# EAGLE design 1highfront (EAGLE 4.11)
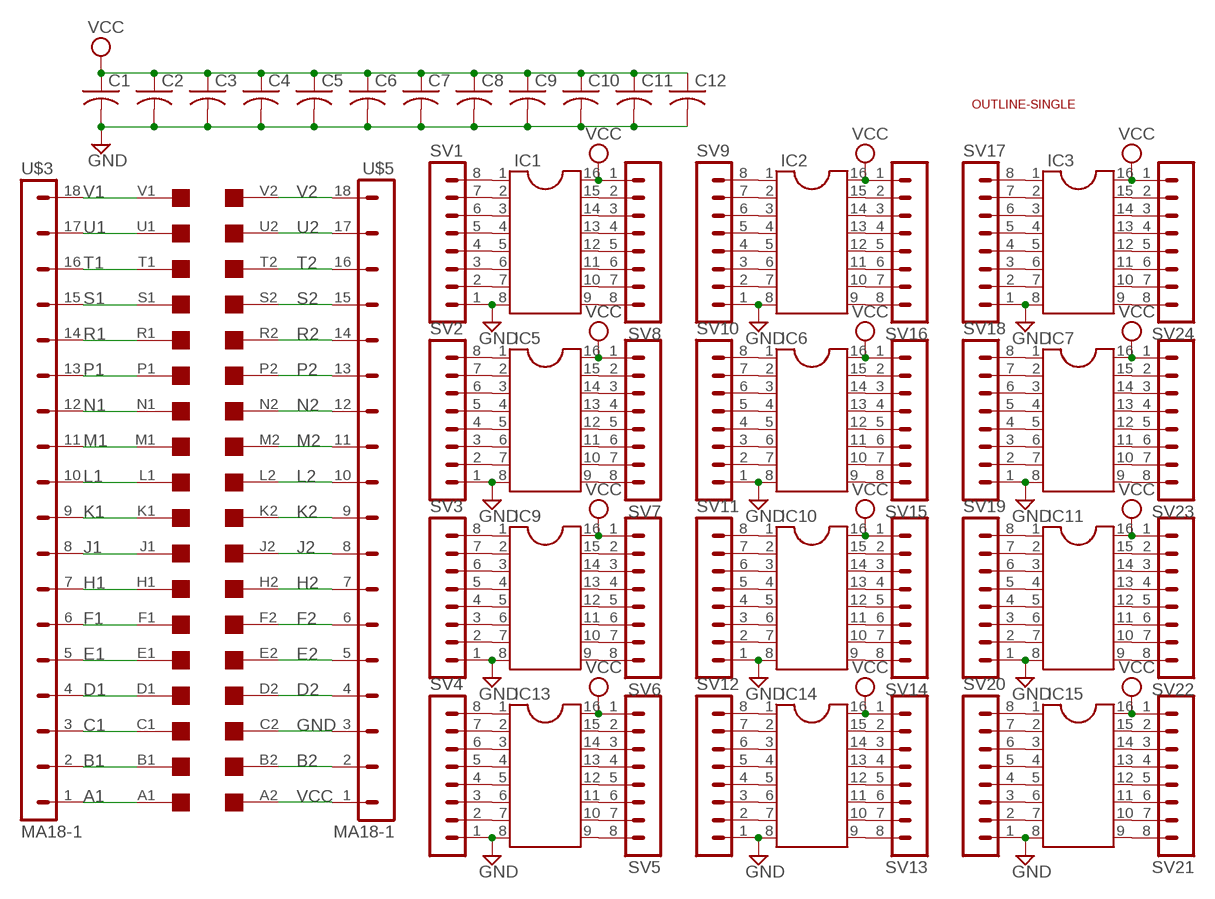
[diagram p0: schematic, sheet 1]

## Parts
C1  C-US050-025X075  [C050-025X075]
C2  C-US050-025X075  [C050-025X075]
C3  C-US050-025X075  [C050-025X075]
C4  C-US050-025X075  [C050-025X075]
C5  C-US050-025X075  [C050-025X075]
C6  C-US050-025X075  [C050-025X075]
C7  C-US050-025X075  [C050-025X075]
C8  C-US050-025X075  [C050-025X075]
C9  C-US050-025X075  [C050-025X075]
C10  C-US050-025X075  [C050-025X075]
C11  C-US050-025X075  [C050-025X075]
C12  C-US050-025X075  [C050-025X075]
IC1  DIL16  [DIL16]
IC2  DIL16  [DIL16]
IC3  DIL16  [DIL16]
IC5  DIL16  [DIL16]
IC6  DIL16  [DIL16]
IC7  DIL16  [DIL16]
IC9  DIL16  [DIL16]
IC10  DIL16  [DIL16]
IC11  DIL16  [DIL16]
IC13  DIL16  [DIL16]
IC14  DIL16  [DIL16]
IC15  DIL16  [DIL16]
SV1  MA08-1  [MA08-1]
SV2  MA08-1  [MA08-1]
SV3  MA08-1  [MA08-1]
SV4  MA08-1  [MA08-1]
SV5  MA08-1  [MA08-1]
SV6  MA08-1  [MA08-1]
SV7  MA08-1  [MA08-1]
SV8  MA08-1  [MA08-1]
SV9  MA08-1  [MA08-1]
SV10  MA08-1  [MA08-1]
SV11  MA08-1  [MA08-1]
SV12  MA08-1  [MA08-1]
SV13  MA08-1  [MA08-1]
SV14  MA08-1  [MA08-1]
SV15  MA08-1  [MA08-1]
SV16  MA08-1  [MA08-1]
SV17  MA08-1  [MA08-1]
SV18  MA08-1  [MA08-1]
SV19  MA08-1  [MA08-1]
SV20  MA08-1  [MA08-1]
SV21  MA08-1  [MA08-1]
SV22  MA08-1  [MA08-1]
SV23  MA08-1  [MA08-1]
SV24  MA08-1  [MA08-1]
U$2  OUTLINE-SINGLE  [SINGLE]
U$3  MA18-1  [MA18-1]
U$4  EDGE-2CONNECTOR  [EDGE-CON2]
U$5  MA18-1  [MA18-1]

## Nets
A1: U$3.1 U$4.A1
B1: U$3.2 U$4.B1
B2: U$4.B2 U$5.2
C1: U$3.3 U$4.C1
D1: U$3.4 U$4.D1
D2: U$4.D2 U$5.4
E1: U$3.5 U$4.E1
E2: U$4.E2 U$5.5
F1: U$3.6 U$4.F1
F2: U$4.F2 U$5.6
GND: C1.2 C2.2 C3.2 C4.2 C5.2 C6.2 C7.2 C8.2 C9.2 C10.2 C11.2 C12.2 IC1.8 IC2.8 IC3.8 IC5.8 IC6.8 IC7.8 IC9.8 IC10.8 IC11.8 IC13.8 IC14.8 IC15.8 SV1.1 SV2.1 SV3.1 SV4.1 SV9.1 SV10.1 SV11.1 SV12.1 SV17.1 SV18.1 SV19.1 SV20.1 U$4.C2 U$5.3
H1: U$3.7 U$4.H1
H2: U$4.H2 U$5.7
J1: U$3.8 U$4.J1
J2: U$4.J2 U$5.8
K1: U$3.9 U$4.K1
K2: U$4.K2 U$5.9
L1: U$3.10 U$4.L1
L2: U$4.L2 U$5.10
M1: U$3.11 U$4.M1
M2: U$4.M2 U$5.11
N1: U$3.12 U$4.N1
N2: U$4.N2 U$5.12
N$1: IC1.7 SV1.2
N$2: IC1.6 SV1.3
N$3: IC1.5 SV1.4
N$4: IC1.4 SV1.5
N$5: IC1.3 SV1.6
N$6: IC1.2 SV1.7
N$7: IC1.1 SV1.8
N$8: IC5.7 SV2.2
N$9: IC5.6 SV2.3
N$10: IC5.5 SV2.4
N$11: IC5.4 SV2.5
N$12: IC5.3 SV2.6
N$13: IC5.2 SV2.7
N$14: IC5.1 SV2.8
N$15: IC9.7 SV3.2
N$16: IC9.6 SV3.3
N$17: IC9.5 SV3.4
N$18: IC9.4 SV3.5
N$19: IC9.3 SV3.6
N$20: IC9.2 SV3.7
N$21: IC9.1 SV3.8
N$22: IC13.7 SV4.2
N$23: IC13.6 SV4.3
N$24: IC13.5 SV4.4
N$25: IC13.4 SV4.5
N$26: IC13.3 SV4.6
N$27: IC13.2 SV4.7
N$28: IC13.1 SV4.8
N$29: IC2.1 SV9.8
N$30: IC2.2 SV9.7
N$31: IC2.3 SV9.6
N$32: IC2.4 SV9.5
N$33: IC2.5 SV9.4
N$34: IC2.6 SV9.3
N$35: IC2.7 SV9.2
N$36: IC6.1 SV10.8
N$37: IC6.2 SV10.7
N$38: IC6.3 SV10.6
N$39: IC6.4 SV10.5
N$40: IC6.5 SV10.4
N$41: IC6.6 SV10.3
N$42: IC6.7 SV10.2
N$43: IC10.1 SV11.8
N$44: IC10.2 SV11.7
N$45: IC10.3 SV11.6
N$46: IC10.4 SV11.5
N$47: IC10.5 SV11.4
N$48: IC10.6 SV11.3
N$49: IC10.7 SV11.2
N$50: IC14.1 SV12.8
N$51: IC14.2 SV12.7
N$52: IC14.3 SV12.6
N$53: IC14.4 SV12.5
N$54: IC14.5 SV12.4
N$55: IC14.6 SV12.3
N$56: IC14.7 SV12.2
N$57: IC6.15 SV15.2
N$58: IC6.14 SV15.3
N$59: IC6.13 SV15.4
N$60: IC6.12 SV15.5
N$61: IC6.11 SV15.6
N$62: IC6.10 SV15.7
N$63: IC6.9 SV15.8
N$64: IC10.15 SV14.2
N$65: IC10.14 SV14.3
N$66: IC10.13 SV14.4
N$67: IC10.12 SV14.5
N$68: IC10.11 SV14.6
N$69: IC10.10 SV14.7
N$70: IC10.9 SV14.8
N$71: IC1.9 SV8.8
N$72: IC1.10 SV8.7
N$73: IC1.11 SV8.6
N$74: IC1.12 SV8.5
N$75: IC1.13 SV8.4
N$76: IC1.14 SV8.3
N$77: IC1.15 SV8.2
N$78: IC5.9 SV7.8
N$79: IC5.10 SV7.7
N$80: IC5.11 SV7.6
N$81: IC5.12 SV7.5
N$82: IC5.13 SV7.4
N$83: IC5.14 SV7.3
N$84: IC5.15 SV7.2
N$85: IC2.15 SV16.2
N$86: IC2.14 SV16.3
N$87: IC2.13 SV16.4
N$88: IC2.12 SV16.5
N$89: IC2.11 SV16.6
N$90: IC2.10 SV16.7
N$91: IC2.9 SV16.8
N$92: IC13.15 SV5.2
N$93: IC13.14 SV5.3
N$94: IC13.13 SV5.4
N$95: IC13.12 SV5.5
N$96: IC13.11 SV5.6
N$97: IC13.10 SV5.7
N$98: IC13.9 SV5.8
N$99: IC9.15 SV6.2
N$100: IC9.14 SV6.3
N$101: IC9.13 SV6.4
N$102: IC9.12 SV6.5
N$103: IC9.11 SV6.6
N$104: IC9.10 SV6.7
N$105: IC9.9 SV6.8
N$106: IC14.15 SV13.2
N$107: IC14.14 SV13.3
N$108: IC14.13 SV13.4
N$109: IC14.12 SV13.5
N$110: IC14.11 SV13.6
N$111: IC14.10 SV13.7
N$112: IC14.9 SV13.8
N$113: IC3.7 SV17.2
N$114: IC3.6 SV17.3
N$115: IC3.5 SV17.4
N$116: IC3.4 SV17.5
N$117: IC3.3 SV17.6
N$118: IC3.2 SV17.7
N$119: IC3.1 SV17.8
N$120: IC7.7 SV18.2
N$121: IC7.6 SV18.3
N$122: IC7.5 SV18.4
N$123: IC7.4 SV18.5
N$124: IC7.3 SV18.6
N$125: IC7.2 SV18.7
N$126: IC7.1 SV18.8
N$127: IC11.7 SV19.2
N$128: IC11.6 SV19.3
N$129: IC11.5 SV19.4
N$130: IC11.4 SV19.5
N$131: IC11.3 SV19.6
N$132: IC11.2 SV19.7
N$133: IC11.1 SV19.8
N$134: IC15.7 SV20.2
N$135: IC15.6 SV20.3
N$136: IC15.5 SV20.4
N$137: IC15.4 SV20.5
N$138: IC15.3 SV20.6
N$139: IC15.2 SV20.7
N$140: IC15.1 SV20.8
N$141: IC15.15 SV21.2
N$142: IC15.14 SV21.3
N$143: IC15.13 SV21.4
N$144: IC15.12 SV21.5
N$145: IC15.11 SV21.6
N$146: IC15.10 SV21.7
N$147: IC15.9 SV21.8
N$148: IC11.15 SV22.2
N$149: IC11.14 SV22.3
N$150: IC11.13 SV22.4
N$151: IC11.12 SV22.5
N$152: IC11.11 SV22.6
N$153: IC11.10 SV22.7
N$154: IC11.9 SV22.8
N$155: IC7.15 SV23.2
N$156: IC7.14 SV23.3
N$157: IC7.13 SV23.4
N$158: IC7.12 SV23.5
N$159: IC7.11 SV23.6
N$160: IC7.10 SV23.7
N$161: IC7.9 SV23.8
N$162: IC3.15 SV24.2
N$163: IC3.14 SV24.3
N$164: IC3.13 SV24.4
N$165: IC3.12 SV24.5
N$166: IC3.11 SV24.6
N$167: IC3.10 SV24.7
N$168: IC3.9 SV24.8
P1: U$3.13 U$4.P1
P2: U$4.P2 U$5.13
R1: U$3.14 U$4.R1
R2: U$4.R2 U$5.14
S1: U$3.15 U$4.S1
S2: U$4.S2 U$5.15
T1: U$3.16 U$4.T1
T2: U$4.T2 U$5.16
U1: U$3.17 U$4.U1
U2: U$4.U2 U$5.17
V1: U$3.18 U$4.V1
V2: U$4.V2 U$5.18
VCC: C1.1 C2.1 C3.1 C4.1 C5.1 C6.1 C7.1 C8.1 C9.1 C10.1 C11.1 C12.1 IC1.16 IC2.16 IC3.16 IC5.16 IC6.16 IC7.16 IC9.16 IC10.16 IC11.16 IC13.16 IC14.16 IC15.16 SV5.1 SV6.1 SV7.1 SV8.1 SV13.1 SV14.1 SV15.1 SV16.1 SV21.1 SV22.1 SV23.1 SV24.1 U$4.A2 U$5.1

## Library data of the parts
C1-C12 = rcl:C-US: CAPACITOR, American symbol
IC1-IC3 IC5-IC7 IC9-IC11 IC13-IC15 = ic-package:DIL16: Dual In Line
SV1-SV24 = con-lstb:MA08-1: PIN HEADER
U$2 = dec-con:OUTLINE-*: Board outlines for DEC boards.
U$3 U$5 = dec-con:MA18-1
U$4 = dec-con:EDGE-2: Double-Sided DEC edge connector.

## Board
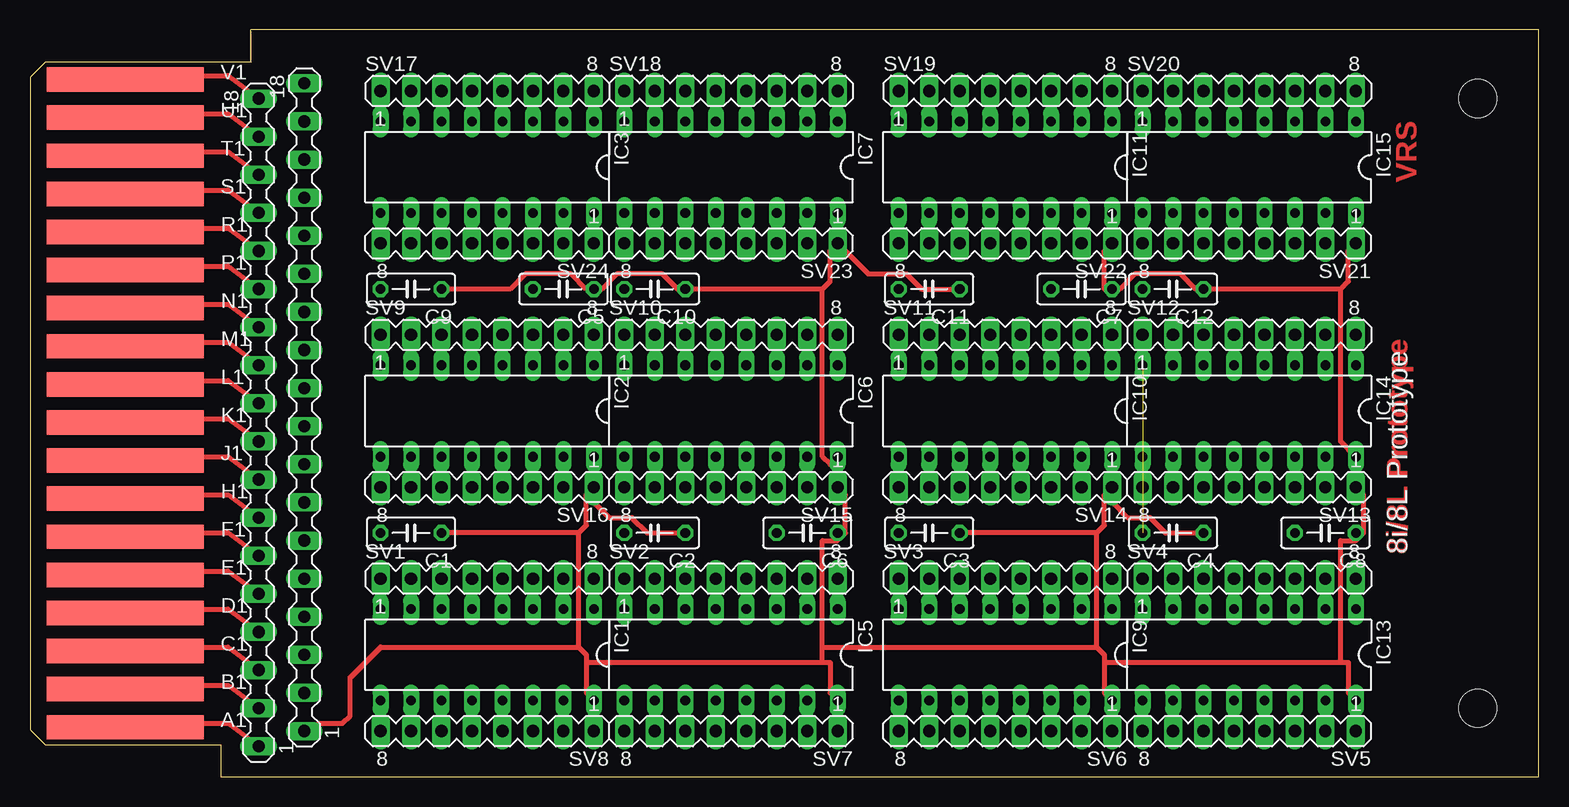
[diagram p1: board, top side]
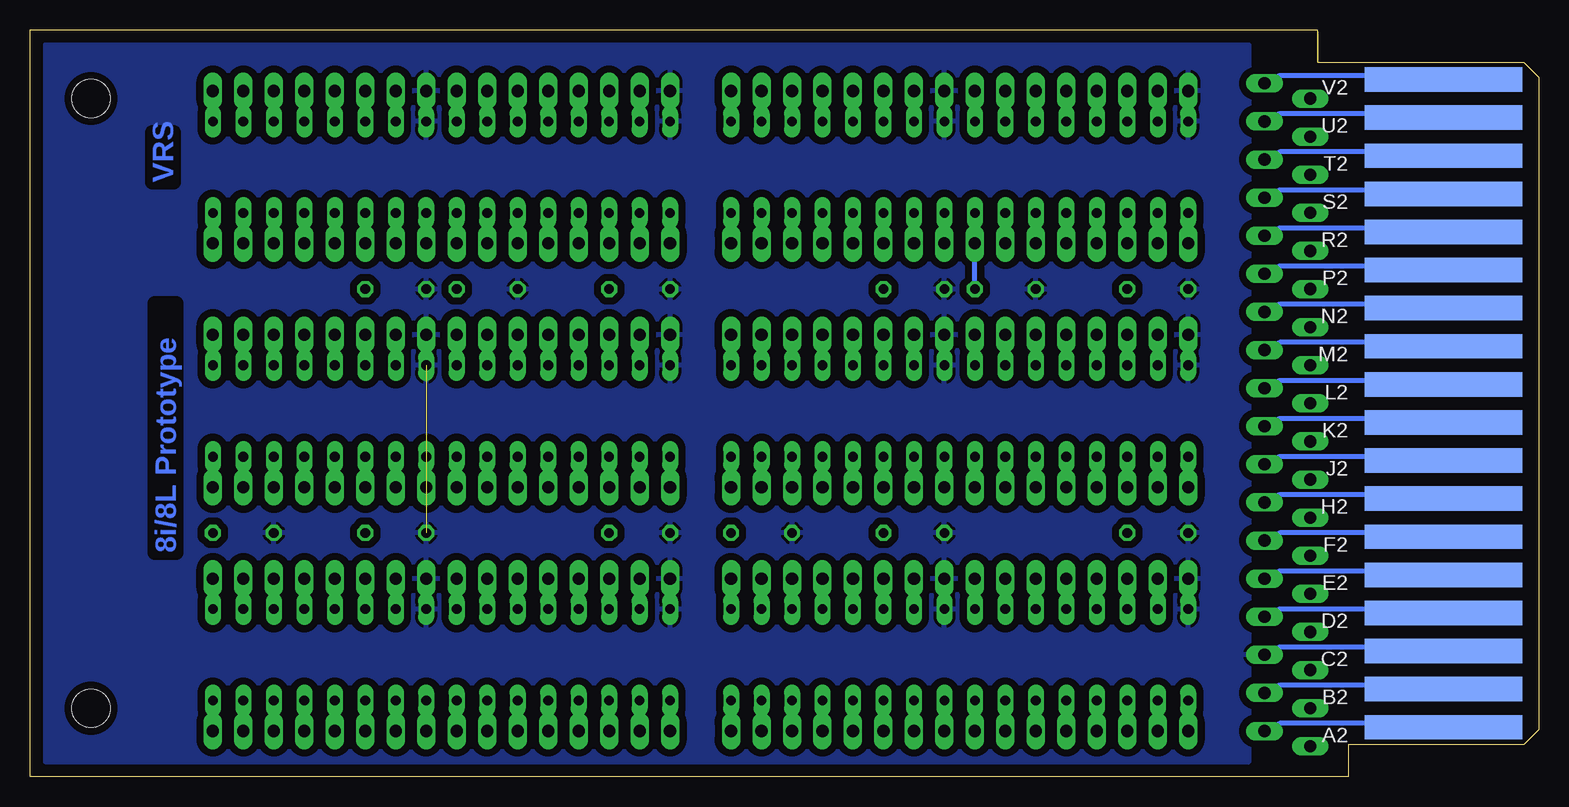
[diagram p2: board, bottom side, seen from below]

Size 125.73 x 62.23 mm. Coordinates in mm from the lower left corner, seen from the top.
Copper layers (1+16): Top 0.035mm / dielectric 1.5mm / Bottom 0.035mm
Design rules "16mils": minimum track width 16mil, minimum drill 32mil, track to track 15mil, track to pad 10mil, pad to pad 10mil, via to via 10mil, smd to smd 10mil, copper to edge 13mil, drill to drill 10mil, minimum pad ring 10mil, minimum via ring 8mil, stop-mask expansion 0mil, vias tented up to drill 0mil, thermal gap 10mil

### Footprints (pad centres in the part's own frame; a part is rotated, then mirrored left to right if it is on the bottom)
C050-025X075 = drill 0.813 octagon: 1 -2.54,0; 2 2.54,0
DIL16 = drill 0.813 long: 1 -8.89,-3.81; 2 -6.35,-3.81; 3 -3.81,-3.81; 4 -1.27,-3.81; 5 1.27,-3.81; 6 3.81,-3.81; 7 6.35,-3.81; 8 8.89,-3.81; 9 8.89,3.81; 10 6.35,3.81; 11 3.81,3.81; 12 1.27,3.81; 13 -1.27,3.81; 14 -3.81,3.81; 15 -6.35,3.81; 16 -8.89,3.81
MA08-1 = drill 1.016 long: 1 -8.89,0; 2 -6.35,0; 3 -3.81,0; 4 -1.27,0; 5 1.27,0; 6 3.81,0; 7 6.35,0; 8 8.89,0
SINGLE = hole 3.175: 120.65,56.515; 120.65,5.715
MA18-1 = drill 1.016 long: 1 -25.4,0; 2 -22.225,0; 3 -19.05,0; 4 -15.875,0; 5 -12.7,0; 6 -9.525,0; 7 -6.35,0; 8 -3.175,0; 9 0,0; 10 3.175,0; 11 6.35,0; 12 9.525,0; 13 12.7,0; 14 15.875,0; 15 19.05,0; 16 22.225,0; 17 25.4,0; 18 28.575,0
EDGE-CON2 = smd 13.106 x 2.032: A1 7.938,4.128; B1 7.938,7.303; C1 7.938,10.477; D1 7.938,13.652; E1 7.938,16.828; F1 7.938,20.003; H1 7.938,23.177; J1 7.938,26.352; K1 7.938,29.527; L1 7.938,32.703; M1 7.938,35.877; N1 7.938,39.053; P1 7.938,42.227; R1 7.938,45.403; S1 7.938,48.578; T1 7.938,51.752; U1 7.938,54.928; V1 7.938,58.102 | smd 13.106 x 2.032 bottom: A2 7.938,4.128; B2 7.938,7.303; C2 7.938,10.477; D2 7.938,13.652; E2 7.938,16.828; F2 7.938,20.003; H2 7.938,23.177; J2 7.938,26.352; K2 7.938,29.527; L2 7.938,32.703; M2 7.938,35.877; N2 7.938,39.053; P2 7.938,42.227; R2 7.938,45.403; S2 7.938,48.578; T2 7.938,51.752; U2 7.938,54.928; V2 7.938,58.102

### Placement (x,y rotation side)
C1  31.75,20.32 180 top
C2  52.07,20.32 180 top
C3  74.93,20.32 180 top
C4  95.25,20.32 180 top
C5  44.45,40.64 180 top
C6  64.77,20.32 180 top
C7  87.63,40.64 180 top
C8  107.95,20.32 180 top
C9  31.75,40.64 180 top
C10  52.07,40.64 180 top
C11  74.93,40.64 180 top
C12  95.25,40.64 180 top
IC1  38.1,10.16 180 top
IC2  38.1,30.48 180 top
IC3  38.1,50.8 180 top
IC5  58.42,10.16 180 top
IC6  58.42,30.48 180 top
IC7  58.42,50.8 180 top
IC9  81.28,10.16 180 top
IC10  81.28,30.48 180 top
IC11  81.28,50.8 180 top
IC13  101.6,10.16 180 top
IC14  101.6,30.48 180 top
IC15  101.6,50.8 180 top
SV1  38.1,16.51 0 top
SV2  58.42,16.51 0 top
SV3  81.28,16.51 0 top
SV4  101.6,16.51 0 top
SV5  101.6,3.81 180 top
SV6  81.28,3.81 180 top
SV7  58.42,3.81 180 top
SV8  38.1,3.81 180 top
SV9  38.1,36.83 0 top
SV10  58.42,36.83 0 top
SV11  81.28,36.83 0 top
SV12  101.6,36.83 0 top
SV13  101.6,24.13 180 top
SV14  81.28,24.13 180 top
SV15  58.42,24.13 180 top
SV16  38.1,24.13 180 top
SV17  38.1,57.15 0 top
SV18  58.42,57.15 0 top
SV19  81.28,57.15 0 top
SV20  101.6,57.15 0 top
SV21  101.6,44.45 180 top
SV22  81.28,44.45 180 top
SV23  58.42,44.45 180 top
SV24  38.1,44.45 180 top
U$2  0,0 0 top
U$3  19.05,27.94 90 top
U$4  0,0 0 top
U$5  22.86,29.21 90 top

### Tracks (layer width: path | path; a pad name or v marks a point on that pad's centre or on a via)
A1
  Top 0.406: U$3.1 16.51,4.45 13.97,4.45 U$4.A1
B1
  Top 0.406: U$3.2 16.51,7.62 13.97,7.62 U$4.B1
B2
  Bottom 0.406: U$5.2 21.59,7.62 13.97,7.62 U$4.B2
C1
  Top 0.406: U$3.3 16.51,10.79 13.97,10.79 U$4.C1
D1
  Top 0.406: U$3.4 16.51,13.97 13.97,13.97 U$4.D1
D2
  Bottom 0.406: U$5.4 21.59,13.97 13.97,13.97 U$4.D2
E1
  Top 0.406: U$3.5 16.51,17.14 13.97,17.14 U$4.E1
E2
  Bottom 0.406: U$5.5 21.59,17.14 13.97,17.14 U$4.E2
F1
  Top 0.406: U$3.6 16.51,20.32 13.97,20.32 U$4.F1
F2
  Bottom 0.406: U$5.6 21.59,20.32 13.97,20.32 U$4.F2
GND  (1 unrouted)
  Bottom 0.406: 24.13,10.35 24.13,10.16 U$5.3 21.59,10.79 13.97,10.79 U$4.C2
  pour Bottom (isolate 0.61): 24.13,60.96 124.46,60.96 124.46,1.27 24.13,1.27
H1
  Top 0.406: U$3.7 16.51,23.5 13.97,23.5 U$4.H1
H2
  Bottom 0.406: U$5.7 21.59,23.5 13.97,23.5 U$4.H2
J1
  Top 0.406: U$3.8 16.51,26.67 13.97,26.67 U$4.J1
J2
  Bottom 0.406: U$5.8 21.59,26.67 13.97,26.67 U$4.J2
K1
  Top 0.406: U$3.9 16.51,29.84 13.97,29.84 U$4.K1
K2
  Bottom 0.406: U$5.9 21.59,29.84 13.97,29.84 U$4.K2
L1
  Top 0.406: U$3.10 16.51,33.02 13.97,33.02 U$4.L1
L2
  Bottom 0.406: U$5.10 21.59,33.02 13.97,33.02 U$4.L2
M1
  Top 0.406: U$3.11 16.51,36.2 13.97,36.2 U$4.M1
M2
  Bottom 0.406: U$5.11 21.59,36.2 13.97,36.2 U$4.M2
N1
  Top 0.406: U$3.12 16.51,39.37 13.97,39.37 U$4.N1
N2
  Bottom 0.406: U$5.12 21.59,39.37 13.97,39.37 U$4.N2
N$1
  Bottom 0.406: IC1.7 SV1.2
N$2
  Bottom 0.406: IC1.6 SV1.3
N$3
  Bottom 0.406: IC1.5 SV1.4
N$4
  Bottom 0.406: IC1.4 SV1.5
N$5
  Bottom 0.406: IC1.3 SV1.6
N$6
  Bottom 0.406: IC1.2 SV1.7
N$7
  Bottom 0.406: IC1.1 SV1.8
N$8
  Bottom 0.406: IC5.7 SV2.2
N$9
  Bottom 0.406: IC5.6 SV2.3
N$10
  Bottom 0.406: IC5.5 SV2.4
N$11
  Bottom 0.406: IC5.4 SV2.5
N$12
  Bottom 0.406: IC5.3 SV2.6
N$13
  Bottom 0.406: IC5.2 SV2.7
N$14
  Bottom 0.406: IC5.1 SV2.8
N$15
  Bottom 0.406: IC9.7 SV3.2
N$16
  Bottom 0.406: IC9.6 SV3.3
N$17
  Bottom 0.406: IC9.5 SV3.4
N$18
  Bottom 0.406: IC9.4 SV3.5
N$19
  Bottom 0.406: IC9.3 SV3.6
N$20
  Bottom 0.406: IC9.2 SV3.7
N$21
  Bottom 0.406: IC9.1 SV3.8
N$22
  Bottom 0.406: IC13.7 SV4.2
N$23
  Bottom 0.406: IC13.6 SV4.3
N$24
  Bottom 0.406: IC13.5 SV4.4
N$25
  Bottom 0.406: IC13.4 SV4.5
N$26
  Bottom 0.406: IC13.3 SV4.6
N$27
  Bottom 0.406: IC13.2 SV4.7
N$28
  Bottom 0.406: IC13.1 SV4.8
N$29
  Bottom 0.406: IC2.1 SV9.8
N$30
  Bottom 0.406: IC2.2 SV9.7
N$31
  Bottom 0.406: IC2.3 SV9.6
N$32
  Bottom 0.406: IC2.4 SV9.5
N$33
  Bottom 0.406: IC2.5 SV9.4
N$34
  Bottom 0.406: IC2.6 SV9.3
N$35
  Bottom 0.406: IC2.7 SV9.2
N$36
  Bottom 0.406: IC6.1 SV10.8
N$37
  Bottom 0.406: IC6.2 SV10.7
N$38
  Bottom 0.406: IC6.3 SV10.6
N$39
  Bottom 0.406: IC6.4 SV10.5
N$40
  Bottom 0.406: IC6.5 SV10.4
N$41
  Bottom 0.406: IC6.6 SV10.3
N$42
  Bottom 0.406: IC6.7 SV10.2
N$43
  Bottom 0.406: IC10.1 SV11.8
N$44
  Bottom 0.406: IC10.2 SV11.7
N$45
  Bottom 0.406: IC10.3 SV11.6
N$46
  Bottom 0.406: IC10.4 SV11.5
N$47
  Bottom 0.406: IC10.5 SV11.4
N$48
  Bottom 0.406: IC10.6 SV11.3
N$49
  Bottom 0.406: IC10.7 SV11.2
N$50
  Bottom 0.406: IC14.1 SV12.8
N$51
  Bottom 0.406: IC14.2 SV12.7
N$52
  Bottom 0.406: IC14.3 SV12.6
N$53
  Bottom 0.406: IC14.4 SV12.5
N$54
  Bottom 0.406: IC14.5 SV12.4
N$55
  Bottom 0.406: IC14.6 SV12.3
N$56
  Bottom 0.406: IC14.7 SV12.2
N$57
  Bottom 0.406: SV15.2 IC6.15
N$58
  Bottom 0.406: SV15.3 IC6.14
N$59
  Bottom 0.406: SV15.4 IC6.13
N$60
  Bottom 0.406: SV15.5 IC6.12
N$61
  Bottom 0.406: SV15.6 IC6.11
N$62
  Bottom 0.406: SV15.7 IC6.10
N$63
  Bottom 0.406: SV15.8 IC6.9
N$64
  Bottom 0.406: SV14.2 IC10.15
N$65
  Bottom 0.406: SV14.3 IC10.14
N$66
  Bottom 0.406: SV14.4 IC10.13
N$67
  Bottom 0.406: SV14.5 IC10.12
N$68
  Bottom 0.406: SV14.6 IC10.11
N$69
  Bottom 0.406: SV14.7 IC10.10
N$70
  Bottom 0.406: SV14.8 IC10.9
N$71
  Bottom 0.406: SV8.8 IC1.9
N$72
  Bottom 0.406: SV8.7 IC1.10
N$73
  Bottom 0.406: SV8.6 IC1.11
N$74
  Bottom 0.406: SV8.5 IC1.12
N$75
  Bottom 0.406: SV8.4 IC1.13
N$76
  Bottom 0.406: SV8.3 IC1.14
N$77
  Bottom 0.406: SV8.2 IC1.15
N$78
  Bottom 0.406: SV7.8 IC5.9
N$79
  Bottom 0.406: SV7.7 IC5.10
N$80
  Bottom 0.406: SV7.6 IC5.11
N$81
  Bottom 0.406: SV7.5 IC5.12
N$82
  Bottom 0.406: SV7.4 IC5.13
N$83
  Bottom 0.406: SV7.3 IC5.14
N$84
  Bottom 0.406: SV7.2 IC5.15
N$85
  Bottom 0.406: SV16.2 IC2.15
N$86
  Bottom 0.406: SV16.3 IC2.14
N$87
  Bottom 0.406: SV16.4 IC2.13
N$88
  Bottom 0.406: SV16.5 IC2.12
N$89
  Bottom 0.406: SV16.6 IC2.11
N$90
  Bottom 0.406: SV16.7 IC2.10
N$91
  Bottom 0.406: SV16.8 IC2.9
N$92
  Bottom 0.406: SV5.2 IC13.15
N$93
  Bottom 0.406: SV5.3 IC13.14
N$94
  Bottom 0.406: SV5.4 IC13.13
N$95
  Bottom 0.406: SV5.5 IC13.12
N$96
  Bottom 0.406: SV5.6 IC13.11
N$97
  Bottom 0.406: SV5.7 IC13.10
N$98
  Bottom 0.406: SV5.8 IC13.9
N$99
  Bottom 0.406: SV6.2 IC9.15
N$100
  Bottom 0.406: SV6.3 IC9.14
N$101
  Bottom 0.406: SV6.4 IC9.13
N$102
  Bottom 0.406: SV6.5 IC9.12
N$103
  Bottom 0.406: SV6.6 IC9.11
N$104
  Bottom 0.406: SV6.7 IC9.10
N$105
  Bottom 0.406: SV6.8 IC9.9
N$106
  Bottom 0.406: SV13.2 IC14.15
N$107
  Bottom 0.406: SV13.3 IC14.14
N$108
  Bottom 0.406: SV13.4 IC14.13
N$109
  Bottom 0.406: SV13.5 IC14.12
N$110
  Bottom 0.406: SV13.6 IC14.11
N$111
  Bottom 0.406: SV13.7 IC14.10
N$112
  Bottom 0.406: SV13.8 IC14.9
N$113
  Bottom 0.406: IC3.7 SV17.2
N$114
  Bottom 0.406: IC3.6 SV17.3
N$115
  Bottom 0.406: IC3.5 SV17.4
N$116
  Bottom 0.406: IC3.4 SV17.5
N$117
  Bottom 0.406: IC3.3 SV17.6
N$118
  Bottom 0.406: IC3.2 SV17.7
N$119
  Bottom 0.406: IC3.1 SV17.8
N$120
  Bottom 0.406: IC7.7 SV18.2
N$121
  Bottom 0.406: IC7.6 SV18.3
N$122
  Bottom 0.406: IC7.5 SV18.4
N$123
  Bottom 0.406: IC7.4 SV18.5
N$124
  Bottom 0.406: IC7.3 SV18.6
N$125
  Bottom 0.406: IC7.2 SV18.7
N$126
  Bottom 0.406: IC7.1 SV18.8
N$127
  Bottom 0.406: IC11.7 SV19.2
N$128
  Bottom 0.406: IC11.6 SV19.3
N$129
  Bottom 0.406: IC11.5 SV19.4
N$130
  Bottom 0.406: IC11.4 SV19.5
N$131
  Bottom 0.406: IC11.3 SV19.6
N$132
  Bottom 0.406: IC11.2 SV19.7
N$133
  Bottom 0.406: IC11.1 SV19.8
N$134
  Bottom 0.406: IC15.7 SV20.2
N$135
  Bottom 0.406: IC15.6 SV20.3
N$136
  Bottom 0.406: IC15.5 SV20.4
N$137
  Bottom 0.406: IC15.4 SV20.5
N$138
  Bottom 0.406: IC15.3 SV20.6
N$139
  Bottom 0.406: IC15.2 SV20.7
N$140
  Bottom 0.406: IC15.1 SV20.8
N$141
  Bottom 0.406: SV21.2 IC15.15
N$142
  Bottom 0.406: SV21.3 IC15.14
N$143
  Bottom 0.406: SV21.4 IC15.13
N$144
  Bottom 0.406: SV21.5 IC15.12
N$145
  Bottom 0.406: SV21.6 IC15.11
N$146
  Bottom 0.406: SV21.7 IC15.10
N$147
  Bottom 0.406: SV21.8 IC15.9
N$148
  Bottom 0.406: SV22.2 IC11.15
N$149
  Bottom 0.406: SV22.3 IC11.14
N$150
  Bottom 0.406: SV22.4 IC11.13
N$151
  Bottom 0.406: SV22.5 IC11.12
N$152
  Bottom 0.406: SV22.6 IC11.11
N$153
  Bottom 0.406: SV22.7 IC11.10
N$154
  Bottom 0.406: SV22.8 IC11.9
N$155
  Bottom 0.406: SV23.2 IC7.15
N$156
  Bottom 0.406: SV23.3 IC7.14
N$157
  Bottom 0.406: SV23.4 IC7.13
N$158
  Bottom 0.406: SV23.5 IC7.12
N$159
  Bottom 0.406: SV23.6 IC7.11
N$160
  Bottom 0.406: SV23.7 IC7.10
N$161
  Bottom 0.406: SV23.8 IC7.9
N$162
  Bottom 0.406: SV24.2 IC3.15
N$163
  Bottom 0.406: SV24.3 IC3.14
N$164
  Bottom 0.406: SV24.4 IC3.13
N$165
  Bottom 0.406: SV24.5 IC3.12
N$166
  Bottom 0.406: SV24.6 IC3.11
N$167
  Bottom 0.406: SV24.7 IC3.10
N$168
  Bottom 0.406: SV24.8 IC3.9
P1
  Top 0.406: U$3.13 16.51,42.55 13.97,42.55 U$4.P1
P2
  Bottom 0.406: U$5.13 21.59,42.55 13.97,42.55 U$4.P2
R1
  Top 0.406: U$3.14 16.51,45.72 13.97,45.72 U$4.R1
R2
  Bottom 0.406: U$5.14 21.59,45.72 13.97,45.72 U$4.R2
S1
  Top 0.406: U$3.15 16.51,48.9 13.97,48.9 U$4.S1
S2
  Bottom 0.406: U$5.15 21.59,48.9 13.97,48.9 U$4.S2
T1
  Top 0.406: U$3.16 16.51,52.07 13.97,52.07 U$4.T1
T2
  Bottom 0.406: U$5.16 21.59,52.07 13.97,52.07 U$4.T2
U1
  Top 0.406: U$3.17 16.51,55.24 13.97,55.24 U$4.U1
U2
  Bottom 0.406: U$5.17 21.59,55.24 13.97,55.24 U$4.U2
V1
  Top 0.406: U$3.18 16.51,58.42 13.97,58.42 U$4.V1
V2
  Bottom 0.406: U$5.18 21.59,58.42 13.97,58.42 U$4.V2
VCC
  Top 0.406: SV22.1 89.54,43.81 89.54,40.64 C7.1 90.81,40.64 92.08,41.91 95.89,41.91 97.16,40.64 C12.1 109.22,40.64 | 109.22,40.64 109.86,41.27 109.86,43.81 SV21.1 | SV13.1 111.13,23.5 111.13,20.32 C8.1 110.49,19.68 109.22,19.68 109.22,9.53 | 88.9,20.32 89.54,20.95 89.54,23.5 SV14.1 90.17,22.86 91.44,21.59 93.35,21.59 94.62,20.32 C4.1 | 88.9,20.32 C3.1 | 89.54,9.53 89.54,10.16 88.9,10.79 | 89.54,9.53 89.54,6.99 IC9.16 | 88.9,10.79 88.9,20.32 | 89.54,9.53 109.22,9.53 | 109.22,9.53 109.86,9.53 109.86,6.99 IC13.16 | 109.22,40.64 109.22,27.94 IC14.16 | C9.1 40.01,40.64 41.28,41.91 45.09,41.91 46.36,40.64 C5.1 47.63,40.64 48.9,41.91 52.71,41.91 53.98,40.64 C10.1 66.04,40.64 | 66.04,40.64 66.68,41.27 66.68,43.81 SV23.1 69.85,41.91 73.03,41.91 74.3,40.64 C11.1 | SV15.1 67.95,23.5 67.95,20.32 C6.1 67.31,19.68 66.04,19.68 66.04,10.79 | 45.72,20.32 46.36,20.95 46.36,23.5 SV16.1 46.99,22.86 48.26,21.59 50.17,21.59 51.44,20.32 C2.1 | 45.72,20.32 C1.1 | 46.36,9.53 46.36,10.16 45.72,10.79 | 46.36,9.53 46.36,6.99 IC1.16 | 45.72,10.79 45.72,20.32 | 46.36,9.53 66.04,9.53 | 66.04,9.53 66.68,9.53 66.68,6.99 IC5.16 | 66.04,9.53 66.04,10.79 | 45.72,10.79 29.21,10.79 26.67,8.26 26.67,5.08 26.04,4.45 24.13,4.45 U$5.1 | 66.04,40.64 66.04,26.67 66.68,26.04 IC6.16 | 66.04,10.79 88.9,10.79
  Bottom 0.406: SV22.1 IC11.16 | SV21.1 IC15.16 | SV13.1 IC14.16 | IC13.16 SV5.1 | IC9.16 SV6.1 | SV14.1 IC10.16 | IC3.16 SV24.1 C5.1 | SV23.1 IC7.16 | U$5.1 21.59,4.45 13.97,4.45 U$4.A2 | SV15.1 IC6.16 | IC5.16 SV7.1 | IC1.16 SV8.1 | SV16.1 IC2.16

### Text on the board
Top: VRS | 8i/8L Prototype
Bottom: VRS | 8i/8L Prototype
tPlace: 8i/8L Prototype